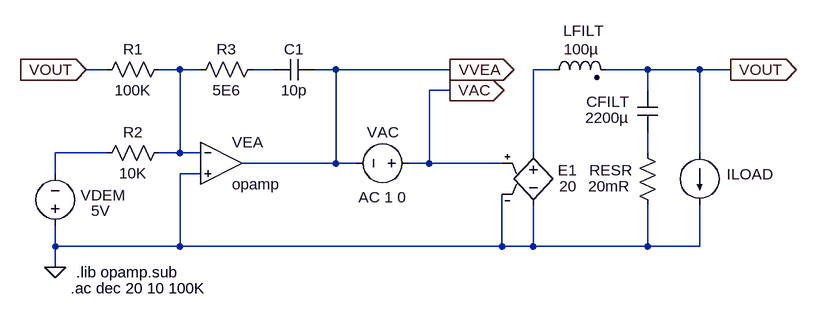
[diagram p0: schematic voltmodelina.asc]
voltmodelina.asc, the LTspice schematic file:
Version 4
SHEET 1 880 1136
WIRE -448 240 -480 240
WIRE -336 240 -368 240
WIRE -304 240 -336 240
WIRE -192 240 -224 240
WIRE -96 240 -128 240
WIRE 80 240 -96 240
WIRE 240 240 208 240
WIRE 384 240 320 240
WIRE 464 240 384 240
WIRE 512 240 464 240
WIRE 80 272 48 272
WIRE 384 272 384 240
WIRE -448 368 -528 368
WIRE -336 368 -336 240
WIRE -336 368 -368 368
WIRE -304 368 -336 368
WIRE 208 368 208 240
WIRE 384 368 384 336
WIRE 464 368 464 240
WIRE -96 384 -96 240
WIRE -96 384 -240 384
WIRE -64 384 -96 384
WIRE 48 384 48 272
WIRE 48 384 16 384
WIRE 160 384 48 384
WIRE -528 400 -528 368
WIRE -304 400 -336 400
WIRE -528 512 -528 480
WIRE -336 512 -336 400
WIRE -336 512 -528 512
WIRE 160 512 160 432
WIRE 160 512 -336 512
WIRE 208 512 208 448
WIRE 208 512 160 512
WIRE 384 512 384 448
WIRE 384 512 208 512
WIRE 464 512 464 448
WIRE 464 512 384 512
WIRE -528 544 -528 512
FLAG -480 240 VOUT
IOPIN -480 240 In
FLAG -528 544 0
FLAG 80 240 VVEA
IOPIN 80 240 Out
FLAG 512 240 VOUT
IOPIN 512 240 Out
FLAG 80 272 VAC
IOPIN 80 272 Out
SYMBOL ind2 224 256 R270
WINDOW 0 60 62 VTop 0
WINDOW 3 63 58 VBottom 0
SYMATTR InstName LFILT
SYMATTR Value 100µ
SYMATTR Type ind
SYMBOL Opamps\\opamp -272 320 R0
SYMATTR InstName VEA
SYMATTR SpiceLine2 GBW=400Meg
SYMBOL res -208 224 R90
WINDOW 0 0 56 VBottom 0
WINDOW 3 32 56 VTop 0
SYMATTR InstName R3
SYMATTR Value 5E6
SYMBOL cap -128 224 R90
WINDOW 0 0 32 VBottom 0
WINDOW 3 32 32 VTop 0
SYMATTR InstName C1
SYMATTR Value 10p
SYMBOL res -352 224 R90
WINDOW 0 0 56 VBottom 0
WINDOW 3 32 56 VTop 0
SYMATTR InstName R1
SYMATTR Value 100K
SYMBOL res -352 352 R90
WINDOW 0 0 56 VBottom 0
WINDOW 3 32 56 VTop 0
SYMATTR InstName R2
SYMATTR Value 10K
SYMBOL voltage -528 496 R180
WINDOW 0 -108 63 Left 0
WINDOW 3 -85 39 Left 0
WINDOW 123 0 0 Left 0
WINDOW 39 0 0 Left 0
SYMATTR InstName VDEM
SYMATTR Value 5V
SYMBOL cap 368 272 R0
WINDOW 0 -78 17 Left 0
WINDOW 3 -80 42 Left 0
SYMATTR InstName CFILT
SYMATTR Value 2200µ
SYMATTR SpiceLine IC=50V
SYMBOL res 368 352 R0
WINDOW 0 -74 43 Left 0
WINDOW 3 -75 67 Left 0
SYMATTR InstName RESR
SYMATTR Value 20mR
SYMBOL load2 464 368 R0
WINDOW 0 42 33 Left 0
WINDOW 3 42 61 Invisible 0
WINDOW 123 0 0 Left 0
WINDOW 39 0 0 Left 0
SYMATTR InstName ILOAD
SYMATTR Value PULSE(5 15 0 10n 10n 100u 200u)
SYMBOL e 208 352 R0
WINDOW 0 38 43 Left 0
WINDOW 3 40 67 Left 0
SYMATTR InstName E1
SYMATTR Value 20
SYMBOL voltage 32 384 R90
WINDOW 0 -32 56 VBottom 0
WINDOW 3 32 56 VTop 0
WINDOW 123 37 56 VTop 0
WINDOW 39 0 0 Left 0
SYMATTR InstName VAC
SYMATTR Value ""
SYMATTR Value2 AC 1 0
TEXT -496 552 Left 0 !.lib opamp.sub
TEXT -504 576 Left 0 !.ac dec 20 10 100K

The netlist it stands for:
* voltmodelina.asc
LFILT N003 VOUT 100µ
XVEA N001 0 VVEA opamp Aol=100K GBW=400Meg  ; pins invin noninvin out
R3 N002 N001 5E6
C1 VVEA N002 10p
R1 N001 VOUT 100K
R2 N001 N004 10K
VDEM 0 N004 5V
CFILT VOUT N005 2200µ IC=50V
RESR N005 0 20mR
ILOAD VOUT 0 PULSE(5 15 0 10n 10n 100u 200u)
E1 N003 0 VAC 0 20
VAC VAC VVEA AC 1 0
.lib opamp.sub
.ac dec 20 10 100K
.backanno
.end